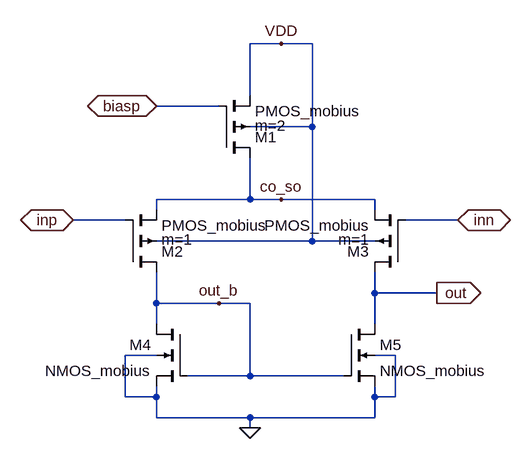
[diagram p0: schematic OTA_pMOS.asc]
OTA_pMOS.asc, the LTspice schematic file:
Version 4
SHEET 1 880 784
WIRE 256 176 208 176
WIRE 304 176 256 176
WIRE 208 256 208 176
WIRE 160 272 64 272
WIRE 304 304 304 176
WIRE 304 304 208 304
WIRE 208 416 208 352
WIRE 208 416 64 416
WIRE 256 416 208 416
WIRE 400 416 256 416
WIRE 64 432 64 416
WIRE 400 432 400 416
WIRE 16 448 -64 448
WIRE 528 448 448 448
WIRE 304 480 304 304
WIRE 304 480 64 480
WIRE 400 480 304 480
WIRE 400 560 400 528
WIRE 496 560 400 560
WIRE 64 576 64 528
WIRE 160 576 64 576
WIRE 208 576 160 576
WIRE 64 608 64 576
WIRE 400 608 400 560
WIRE 64 656 16 656
WIRE 432 656 400 656
WIRE 208 688 208 576
WIRE 208 688 112 688
WIRE 352 688 208 688
WIRE 16 720 16 656
WIRE 64 720 64 704
WIRE 64 720 16 720
WIRE 400 720 400 704
WIRE 432 720 432 656
WIRE 432 720 400 720
WIRE 64 752 64 720
WIRE 208 752 64 752
WIRE 400 752 400 720
WIRE 400 752 208 752
WIRE 208 768 208 752
FLAG 64 272 biasp
IOPIN 64 272 BiDir
FLAG 256 176 VDD
FLAG -64 448 inp
IOPIN -64 448 BiDir
FLAG 528 448 inn
IOPIN 528 448 BiDir
FLAG 496 560 out
IOPIN 496 560 Out
FLAG 208 768 0
FLAG 256 416 co_so
FLAG 160 576 out_b
SYMBOL pmos4 160 352 M180
WINDOW 123 56 50 Left 2
SYMATTR Value2 m=2
SYMATTR InstName M1
SYMATTR Value PMOS_mobius
SYMATTR Prefix X
SYMBOL pmos4 16 528 M180
WINDOW 123 56 50 Left 2
SYMATTR Value2 m=1
SYMATTR InstName M2
SYMATTR Value PMOS_mobius
SYMATTR Prefix X
SYMBOL pmos4 448 528 R180
WINDOW 123 56 50 Left 2
SYMATTR Value2 m=1
SYMATTR InstName M3
SYMATTR Value PMOS_mobius
SYMATTR Prefix X
SYMBOL nmos4 112 608 M0
SYMATTR InstName M4
SYMATTR Value NMOS_mobius
SYMATTR Prefix X
SYMATTR Value2 m=1
SYMBOL nmos4 352 608 R0
SYMATTR InstName M5
SYMATTR Value NMOS_mobius
SYMATTR Prefix X
SYMATTR Value2 m=1

The netlist it stands for:
* OTA_pMOS.asc
XM1 co_so biasp VDD VDD PMOS_mobius m=2  ; pins D G S B
XM2 out_b inp co_so VDD PMOS_mobius m=1  ; pins D G S B
XM3 out inn co_so VDD PMOS_mobius m=1  ; pins D G S B
XM4 out_b out_b 0 0 NMOS_mobius m=1  ; pins D G S B
XM5 out out_b 0 0 NMOS_mobius m=1  ; pins D G S B
.backanno
.end